# EAGLE board board-auto-wover (EAGLE 9.5.2), part 1 of 2
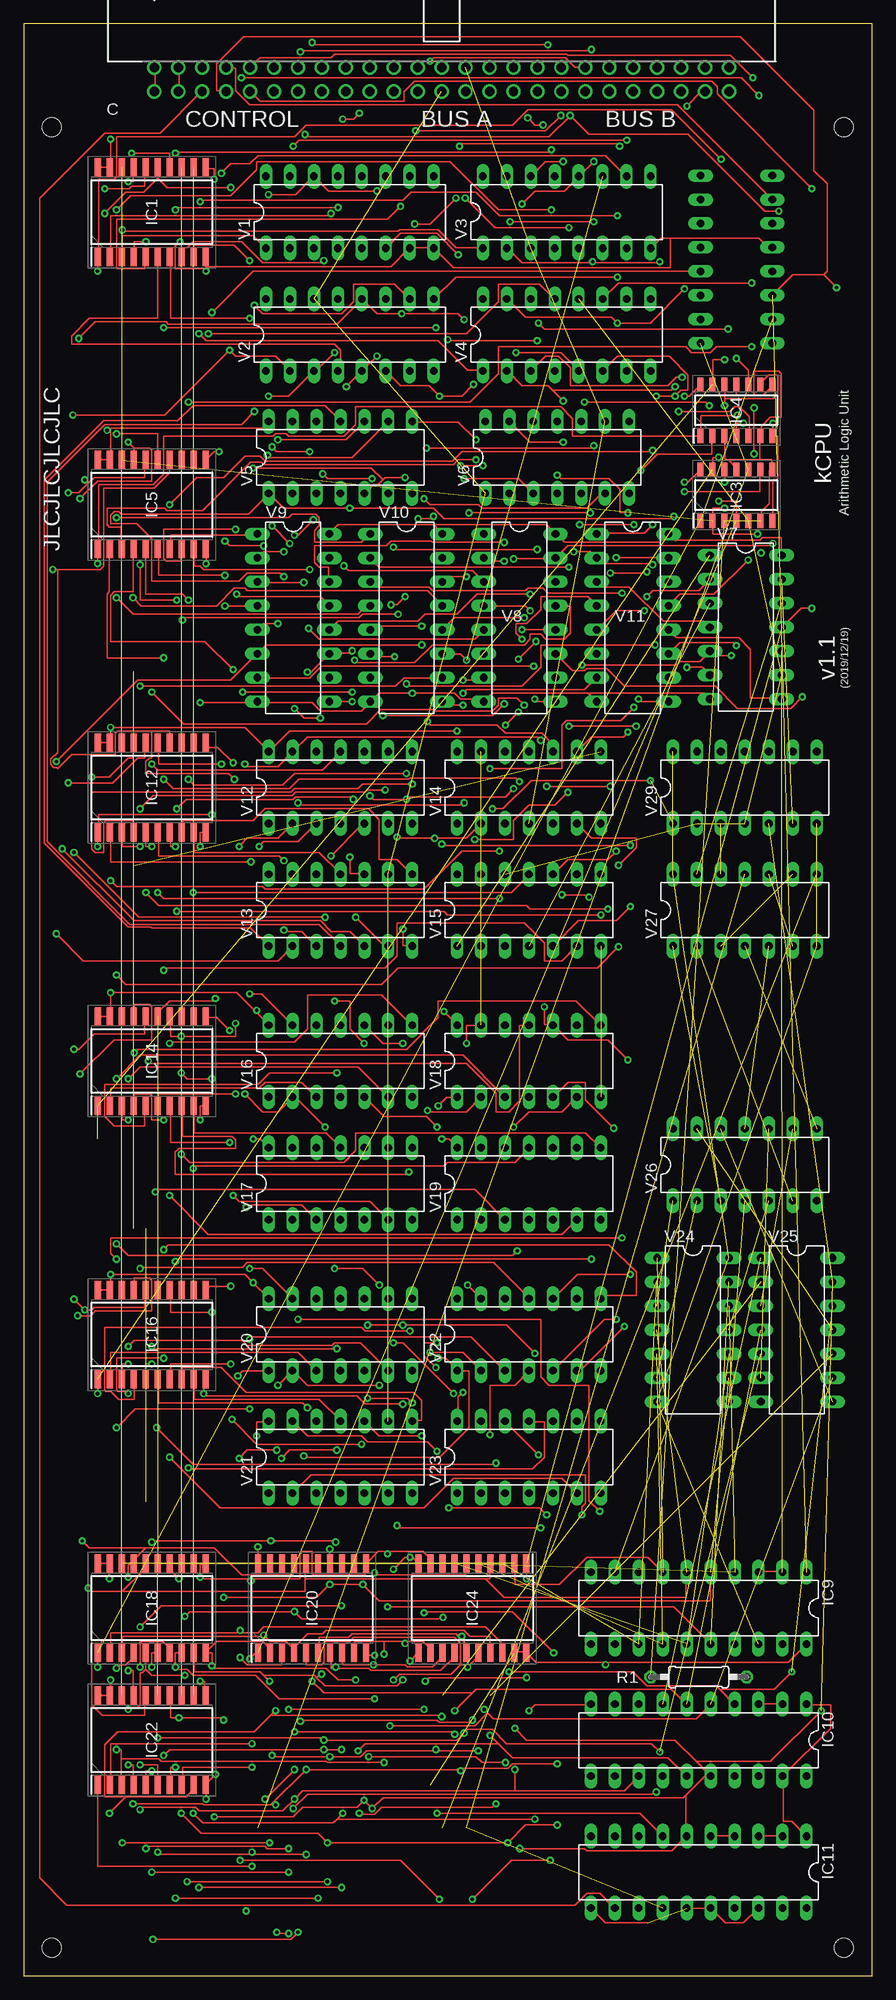
[diagram p7: board, top side]
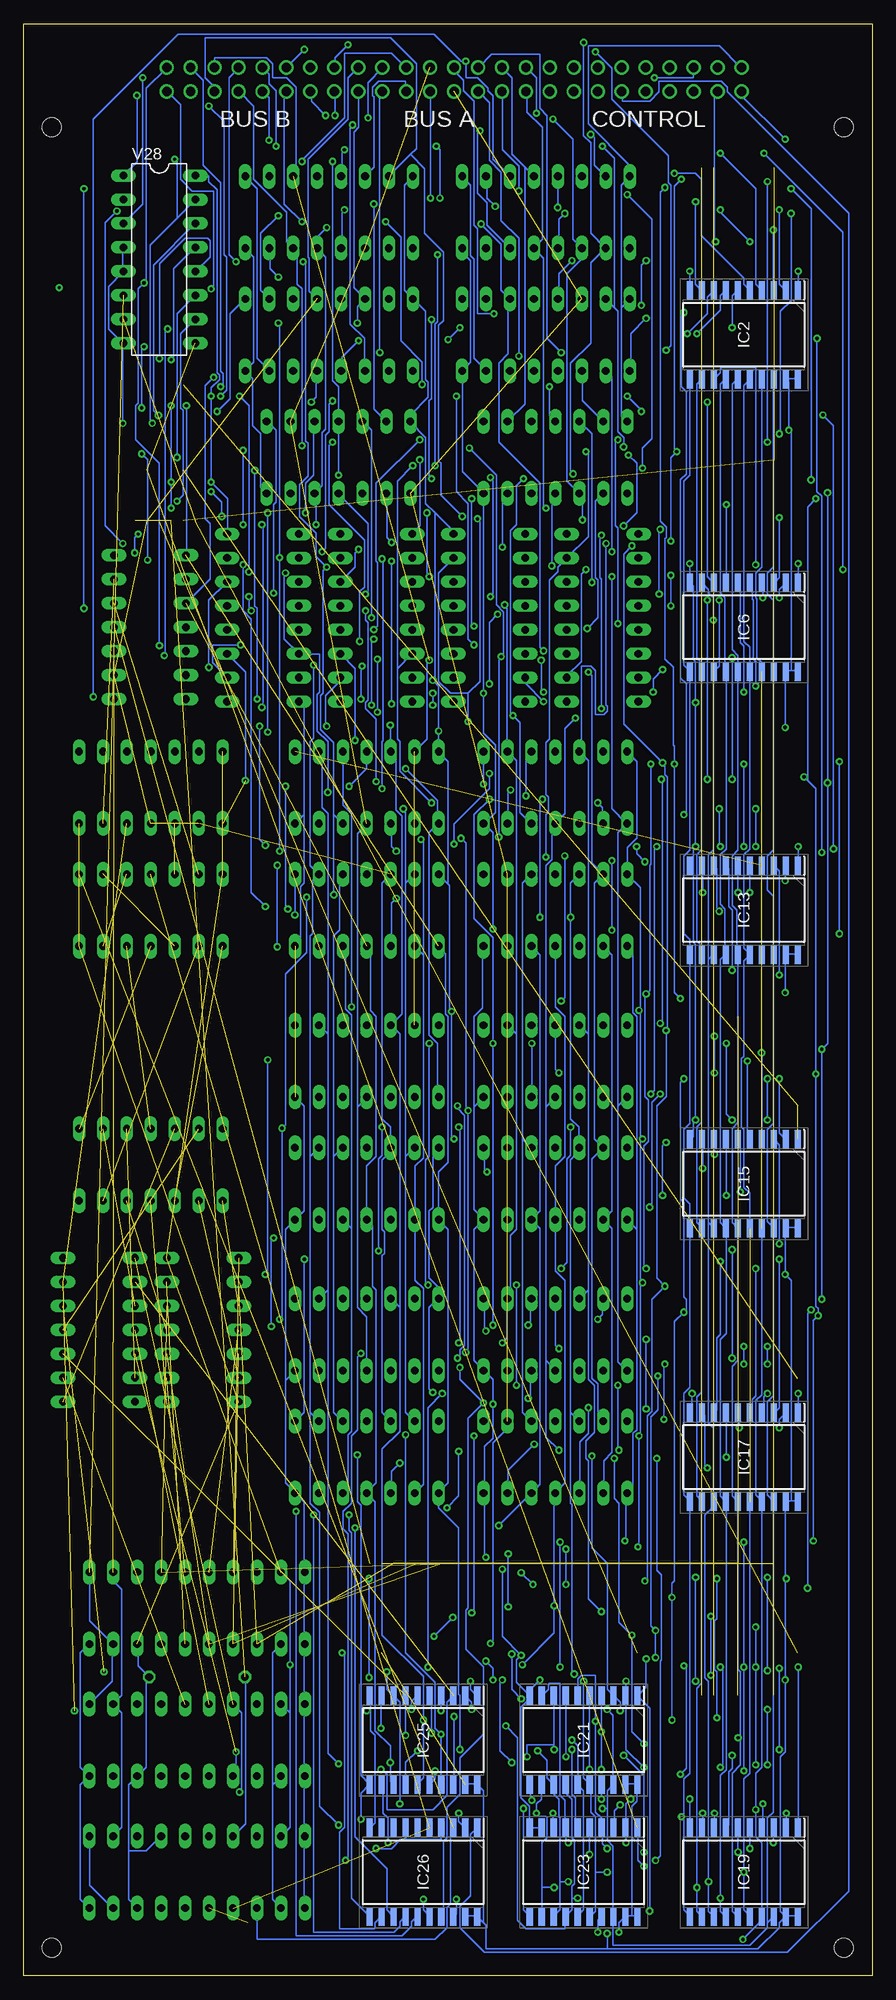
[diagram p8: board, bottom side, seen from below]

Size 90 x 207 mm. Coordinates in mm from the lower left corner, seen from the top.
Outline: 0,0 90,0 90,207 0,207 0,0
Copper layers (1*16): Top 0.035mm / dielectric 1.5mm / Bottom 0.035mm
Design rules "default": minimum track width 6mil, minimum drill 0.35mm, track to track 6mil, track to pad 6mil, pad to pad 6mil, via to via 6mil, smd to smd 6mil, copper to edge 40mil, drill to drill 6mil, minimum pad ring 10mil, minimum via ring 8mil, stop-mask expansion 4mil, vias tented up to drill 0mil, thermal gap 10mil
Holes 2 mm at 3,196 87,196 3,3 87,3

## Footprints (pad centres in the part's own frame; a part is rotated, then mirrored left to right if it is on the bottom)
PAK100/2500-5-50 = drill 1 pad 1.422: 1 -30.48,-1.27; 2 -30.48,1.27; 3 -27.94,-1.27; 4 -27.94,1.27; 5 -25.4,-1.27; 6 -25.4,1.27; 7 -22.86,-1.27; 8 -22.86,1.27; 9 -20.32,-1.27; 10 -20.32,1.27; 11 -17.78,-1.27; 12 -17.78,1.27; 13 -15.24,-1.27; 14 -15.24,1.27; 15 -12.7,-1.27; 16 -12.7,1.27; 17 -10.16,-1.27; 18 -10.16,1.27; 19 -7.62,-1.27; 20 -7.62,1.27; 21 -5.08,-1.27; 22 -5.08,1.27; 23 -2.54,-1.27; 24 -2.54,1.27; 25 0,-1.27; 26 0,1.27; 27 2.54,-1.27; 28 2.54,1.27; 29 5.08,-1.27; 30 5.08,1.27; 31 7.62,-1.27; 32 7.62,1.27; 33 10.16,-1.27; 34 10.16,1.27; 35 12.7,-1.27; 36 12.7,1.27; 37 15.24,-1.27; 38 15.24,1.27; 39 17.78,-1.27; 40 17.78,1.27; 41 20.32,-1.27; 42 20.32,1.27; 43 22.86,-1.27; 44 22.86,1.27; 45 25.4,-1.27; 46 25.4,1.27; 47 27.94,-1.27; 48 27.94,1.27; 49 30.48,-1.27; 50 30.48,1.27
SOIC127P1030X265-20N = smd 1.95 x 0.65: 1 -4.725,5.715; 2 -4.725,4.445; 3 -4.725,3.175; 4 -4.725,1.905; 5 -4.725,0.635; 6 -4.725,-0.635; 7 -4.725,-1.905; 8 -4.725,-3.175; 9 -4.725,-4.445; 10 -4.725,-5.715; 11 4.725,-5.715; 12 4.725,-4.445; 13 4.725,-3.175; 14 4.725,-1.905; 15 4.725,-0.635; 16 4.725,0.635; 17 4.725,1.905; 18 4.725,3.175; 19 4.725,4.445; 20 4.725,5.715
SOIC127P600X175-14N = smd 1.525 x 0.65: 1 -2.712,3.81; 2 -2.712,2.54; 3 -2.712,1.27; 4 -2.712,0; 5 -2.712,-1.27; 6 -2.712,-2.54; 7 -2.712,-3.81; 8 2.712,-3.81; 9 2.712,-2.54; 10 2.712,-1.27; 11 2.712,0; 12 2.712,1.27; 13 2.712,2.54; 14 2.712,3.81
DIL20 = drill 0.813 long: 1 -11.43,-3.81; 2 -8.89,-3.81; 3 -6.35,-3.81; 4 -3.81,-3.81; 5 -1.27,-3.81; 6 1.27,-3.81; 7 3.81,-3.81; 8 6.35,-3.81; 9 8.89,-3.81; 10 11.43,-3.81; 11 11.43,3.81; 12 8.89,3.81; 13 6.35,3.81; 14 3.81,3.81; 15 1.27,3.81; 16 -1.27,3.81; 17 -3.81,3.81; 18 -6.35,3.81; 19 -8.89,3.81; 20 -11.43,3.81
0207/10 = drill 0.813 octagon: 1 -5.08,0; 2 5.08,0
DIL16 = drill 0.813 long: 1 -8.89,-3.81; 2 -6.35,-3.81; 3 -3.81,-3.81; 4 -1.27,-3.81; 5 1.27,-3.81; 6 3.81,-3.81; 7 6.35,-3.81; 8 8.89,-3.81; 9 8.89,3.81; 10 6.35,3.81; 11 3.81,3.81; 12 1.27,3.81; 13 -1.27,3.81; 14 -3.81,3.81; 15 -6.35,3.81; 16 -8.89,3.81
DIL14 = drill 0.813 long: 1 -7.62,-3.81; 2 -5.08,-3.81; 3 -2.54,-3.81; 4 0,-3.81; 5 2.54,-3.81; 6 5.08,-3.81; 7 7.62,-3.81; 8 7.62,3.81; 9 5.08,3.81; 10 2.54,3.81; 11 0,3.81; 12 -2.54,3.81; 13 -5.08,3.81; 14 -7.62,3.81

## Placement (x,y rotation side)
C  2550-5  [PAK100/2500-5-50]  44.34,201.08 0 top
IC1  SN74CBT3345DW  [SOIC127P1030X265-20N]  13.6,187 90 top
IC2  SN74CBT3345DW  [SOIC127P1030X265-20N]  13.6,174 270 bottom
IC3  SN74CBT3126D  [SOIC127P600X175-14N]  75.6,157 90 top
IC4  SN74CBT3126D  [SOIC127P600X175-14N]  75.6,166 90 top
IC5  SN74CBT3345DW  [SOIC127P1030X265-20N]  13.6,156 90 top
IC6  SN74CBT3345DW  [SOIC127P1030X265-20N]  13.6,143 270 bottom
IC9  74S299N  [DIL20]  71.6,39 180 top
IC10  74S299N  [DIL20]  71.6,25 180 top
IC11  74S299N  [DIL20]  71.6,11 180 top
IC12  SN74CBT3345DW  [SOIC127P1030X265-20N]  13.6,126 90 top
IC13  SN74CBT3345DW  [SOIC127P1030X265-20N]  13.6,113 270 bottom
IC14  SN74CBT3345DW  [SOIC127P1030X265-20N]  13.6,97 90 top
IC15  SN74CBT3345DW  [SOIC127P1030X265-20N]  13.6,84 270 bottom
IC16  SN74CBT3345DW  [SOIC127P1030X265-20N]  13.6,68 90 top
IC17  SN74CBT3345DW  [SOIC127P1030X265-20N]  13.6,55 270 bottom
IC18  SN74CBT3345DW  [SOIC127P1030X265-20N]  13.6,39 90 top
IC19  SN74CBT3345DW  [SOIC127P1030X265-20N]  13.6,11 270 bottom
IC20  SN74CBT3345DW  [SOIC127P1030X265-20N]  30.6,39 90 top
IC21  SN74CBT3345DW  [SOIC127P1030X265-20N]  30.6,25 270 bottom
IC22  SN74CBT3345DW  [SOIC127P1030X265-20N]  13.6,25 90 top
IC23  SN74CBT3345DW  [SOIC127P1030X265-20N]  30.6,11 270 bottom
IC24  SN74CBT3345DW  [SOIC127P1030X265-20N]  47.6,39 270 top
IC25  SN74CBT3345DW  [SOIC127P1030X265-20N]  47.6,25 270 bottom
IC26  SN74CBT3345DW  [SOIC127P1030X265-20N]  47.6,11 270 bottom
R1  1k  [0207/10]  71.6,31.7 0 top
V1  74283N  [DIL16]  34.6,187 0 top
V2  74283N  [DIL16]  34.6,174 0 top
V3  74283N  [DIL16]  57.6,187 0 top
V4  74283N  [DIL16]  57.6,174 0 top
V5  7404N  [DIL14]  33.6,161 0 top
V6  7404N  [DIL14]  56.6,161 0 top
V7  7404N  [DIL14]  76.6,143 270 top
V8  74283N  [DIL16]  52.6,144 270 top
V9  74283N  [DIL16]  28.6,144 270 top
V10  74283N  [DIL16]  40.6,144 270 top
V11  74283N  [DIL16]  64.6,144 270 top
V12  7432N  [DIL14]  33.6,126 0 top
V13  7432N  [DIL14]  33.6,113 0 top
V14  7432N  [DIL14]  53.6,126 0 top
V15  7432N  [DIL14]  53.6,113 0 top
V16  7408N  [DIL14]  33.6,97 0 top
V17  7408N  [DIL14]  33.6,84 0 top
V18  7408N  [DIL14]  53.6,97 0 top
V19  7408N  [DIL14]  53.6,84 0 top
V20  7486N  [DIL14]  33.6,68 0 top
V21  7486N  [DIL14]  33.6,55 0 top
V22  7486N  [DIL14]  53.6,68 0 top
V23  7486N  [DIL14]  53.6,55 0 top
V24  7432N  [DIL14]  71,68.5 270 top
V25  7432N  [DIL14]  82,68.5 270 top
V26  7432N  [DIL14]  76.5,86 0 top
V27  7432N  [DIL14]  76.5,113 0 top
V28  74238N  [DIL16]  75.6,182 270 bottom
V29  7486N  [DIL14]  76.5,126 0 top

## Tracks (layer width: path | path; a pad name or v marks a point on that pad's centre or on a via)
BUSA_BIT0  (via drill 0.35)
  Top 0.152: v70.1,157.38 78.1,157.38 78.1,159.62 IC3.9 | v68.97,154.75 68.72,154.5 44.6,154.5 43.48,155.62 v34.6,155.62 27.6,155.62 26.1,157.12 V5.1 25.98,157.12 23.85,155 10.35,155 10.1,155.25 9.6,155.25 9.22,154.88 9.22,154 11.97,154 13.6,152.38 13.6,147.88 22.85,147.88 23.73,148.75 27.23,148.75 v27.6,148.38 | 22.98,36.38 24.85,36.38 25.48,37 48.98,37 50.73,35.25 50.73,34.38 IC24.18 | 22.98,36.38 9.22,36.38 9.22,34.38 IC18.2 | v22.98,33.75 23.73,33 27.35,33 27.35,34.25 IC20.3 | 22.98,36.38 v22.98,36.62 | v22.73,63.62 23.23,64.12 25.98,64.12 V20.1
  Bottom 0.152: C.19 36.6,199.75 36.6,197.62 34.98,196 34.98,184.12 35.85,183.25 V1.5 35.85,183.12 34.85,182.12 34.85,155.88 v34.6,155.62 | v70.1,157.38 68.97,156.25 v68.97,154.75 | v22.98,33.75 v22.98,36.62 23.48,37.12 23.48,59.25 22.73,60 v22.73,63.62 | 26.98,92.25 26.98,65.12 26.1,64.25 V20.1 | 26.98,92.25 26.1,93.12 V16.1 | 26.98,92.25 26.98,121.25 26.1,122.12 V12.1 26.1,122.25 27.6,123.75 v27.6,148.38
BUSA_BIT1  (via drill 0.35)
  Top 0.152: v24.23,24.62 9.22,24.62 9.22,20.38 IC22.2 | 25.6,36 26.1,35.5 27.85,35.5 28.6,34.75 | 28.6,34.75 28.6,34.38 IC20.4 28.6,34.75 | 25.6,36 10.47,36 10.47,34.38 IC18.3 | 25.6,36 v25.48,36.12 | 28.6,34.75 30.1,36.25 31.73,36.25 32.1,36.62 46.73,36.62 47.35,36 49.48,36 49.48,34.38 IC24.17 | v35.6,197.5 34.98,196.88 v33.85,196.88 | v30.73,154.38 29.1,152.75 v28.73,152.75 | v28.73,134.38 29.73,133.38 v31.48,133.38 | v27.35,54.88 28.23,55.75 v33.23,55.75
  Bottom 0.152: v24.23,24.62 25.48,25.88 v25.48,36.12 26.85,37.5 26.85,50.12 27.35,50.62 v27.35,54.88 | v35.6,197.5 35.6,201.25 36.6,202.25 C.20 | v33.85,196.88 31.73,194.75 31.73,184.12 V1.3 30.85,183.12 30.85,182 32.35,180.5 32.35,158.5 31.1,157.25 V5.3 30.98,157.12 30.73,156.88 v30.73,154.38 | 34.6,65.25 33.6,64.25 V20.4 | 34.6,92.12 34.6,65.25 | 34.6,92.12 33.6,93.12 V16.4 | 34.6,92.12 34.6,117.75 33.98,118.38 33.98,121.75 33.6,122.12 V12.4 33.6,122.25 32.6,123.25 32.6,132.25 v31.48,133.38 | v28.73,152.75 28.85,152.62 28.85,148.25 28.73,148.12 v28.73,134.38 | v33.23,55.75 34.6,57.12 34.6,65.25
BUSA_BIT2  (via drill 0.35)
  Top 0.152: 10.35,23 10.35,24 v9.85,24 | 10.35,23 10.35,20.38 IC22.3 | v9.85,32.62 10.22,33 10.85,33 11.6,33.75 11.6,34.25 IC18.4 | 46.35,33 46.35,35.25 45.73,35.88 34.98,35.88 34.6,35.5 31.85,35.5 31.85,33.25 31.6,33 29.98,33 29.98,34.25 IC20.5 | 47.1,33 47.35,33 48.23,33.88 48.23,34.25 IC24.16 | 47.1,33 46.35,33 | 10.35,23 14.35,23 14.6,22.75 32.1,22.75 32.23,22.62 v38.23,22.62 | v39.23,31.38 39.85,32 45.35,32 46.35,33 | v37.48,189.25 32.35,189.25 V1.14 30.73,190.75 28.85,188.88 v25.98,188.88 | 38.1,158.62 38.35,158.88 v40.48,158.88 | 38.1,158.62 37.6,158.12 37.1,158.12 36.23,157.25 V5.5 | v40.48,146.25 39.6,145.38 v38.98,145.38 | v24.35,159.88 36.85,159.88 38.1,158.62 | v47.1,32.75 47.1,33 | v45.6,61.75 40.23,67.12 v39.23,67.12
  Bottom 0.152: v9.85,32.62 v9.85,24 | v38.23,22.62 39.48,23.88 39.48,31.12 v39.23,31.38 | v37.48,189.25 37.48,191.88 39.23,193.62 39.23,199.75 C.21 | 37.73,99.88 37.73,79.12 38.35,78.5 38.35,72.12 38.6,71.88 V20.9 38.73,71.75 38.73,67.62 v39.23,67.12 | 37.73,99.88 38.6,100.75 V16.9 | 37.73,99.88 37.73,128.88 38.6,129.75 V12.9 38.73,129.88 38.73,145.12 v38.98,145.38 | v40.48,158.88 40.23,158.62 40.23,146.5 v40.48,146.25 | v25.98,188.88 23.35,186.25 23.35,163 24.35,162 v24.35,159.88 | v47.1,32.75 47.1,60.25 v45.6,61.75
BUSA_BIT3  (via drill 0.35)
  Top 0.152: 46.23,35.88 46.85,35.25 46.85,34.38 IC24.15 | 46.23,35.88 45.85,36.25 34.85,36.25 34.48,35.88 31.35,35.88 31.35,34.38 IC20.6 | v11.1,22.38 11.6,22.38 11.6,20.38 IC22.4 | v11.1,28.25 11.35,28.5 12.1,28.5 12.35,28.75 12.35,32.12 12.6,32.12 12.97,32.5 | 12.97,32.5 12.97,34.25 IC18.5 | 12.97,32.5 13.6,31.88 v17.1,31.88 | v17.1,38.12 17.6,38.62 v28.73,38.62 29.48,37.88 44.35,37.88 v44.48,38 | 46.23,35.88 46.35,36 v46.48,36 | v25.85,161.25 26.1,161 34.85,161 38.6,164.75 V5.9 | v28.23,151.88 v26.35,153.75
  Bottom 0.152: 36.85,191.75 38.23,193.12 38.23,201.25 39.23,202.25 C.22 | 36.85,191.75 35.98,190.88 V1.12 | 36.85,191.75 36.85,166.62 38.6,164.88 V5.9 | v11.1,28.25 v11.1,22.38 | 30.1,72.75 30.98,71.88 V20.12 | 30.1,99.88 30.1,72.75 | 30.1,99.88 30.98,100.75 V16.12 | 30.85,129.62 30.1,128.88 30.1,99.88 | 30.85,129.62 30.98,129.75 V12.12 30.85,129.62 | v17.1,38.12 v17.1,31.88 | v28.73,38.62 30.1,40 30.1,54.62 30.35,54.88 30.35,56.75 29.48,57.62 29.48,62.62 30.1,63.25 30.1,72.75 | v44.48,38 v46.48,36 | v25.85,161.25 24.98,160.38 24.98,155.12 v26.35,153.75 | v28.23,151.88 28.23,134.75 28.1,134.62 28.1,134.12 28.48,133.75 29.35,133.75 29.35,138.38 29.85,138.88 30.85,138.88 30.85,129.62
BUSA_BIT4  (via drill 0.35)
  Top 0.152: v34.23,168.5 35.85,170.12 V2.5 35.98,170.25 v37.48,171.75 | v13.6,21.75 12.97,21.75 12.97,20.38 IC22.5 | v13.6,32.75 13.6,34.25 14.22,34.25 IC18.6 | 33.1,32.62 36.6,32.62 36.85,32.38 44.23,32.38 45.6,33.75 45.6,34.25 IC24.14 | 33.1,32.62 32.6,32.62 32.6,34.25 IC20.7 | v33.1,32.75 33.1,32.62 | v33.1,46 32.98,46.12 v26.23,46.12 13.72,46.12 v13.6,46 | V5.11 33.6,164.88 31.98,166.5 17.98,166.5 16.35,164.88 8.47,164.88 2.19,158.59 2.19,120.12 11.12,111.19 13.53,111.19 13.6,111.12 24.1,111.12 25.98,109.25 V13.1
  Bottom 0.152: v34.23,168.5 34.23,165.5 33.6,164.88 V5.11 | v37.48,171.75 37.48,184.25 39.35,186.12 39.35,191.25 40.6,192.5 40.6,198.62 41.73,199.75 C.23 | v13.6,21.75 v13.6,32.75 v13.6,46 | 24.98,79.12 24.98,57.88 25.35,57.5 25.35,51.88 25.98,51.25 V21.1 26.1,51.12 26.1,46.25 v26.23,46.12 | 24.98,79.12 25.98,80.12 V17.1 | 24.98,79.12 24.98,101.75 25.35,102.12 25.35,108.5 25.98,109.12 V13.1 | v33.1,46 v33.1,32.75
BUSA_BIT5  (via drill 0.35)
  Top 0.152: v32.98,172.12 31.1,170.25 30.85,170.25 V2.3 28.1,167.5 v25.98,167.5 | v12.35,22.38 14.22,22.38 14.22,20.38 IC22.6 | v12.35,32.75 12.35,35.5 14.72,35.5 15.47,34.75 15.47,34.38 IC18.7 | IC20.8 33.85,34.25 33.85,33 v37.1,33 40.48,33 40.73,32.75 43.35,32.75 44.35,33.75 44.35,34.25 IC24.13 | v12.35,37 14.6,39.25 v33.73,39.25 | v24.48,165.88 23.1,164.5 8.6,164.5 2.49,158.39 2.49,120.25 11.24,111.5 31.35,111.5 33.6,109.25 V13.4
  Bottom 0.152: V5.13 28.6,164.88 30.73,167 30.73,170.12 V2.3 | v32.98,172.12 34.48,173.62 34.48,197.25 35.23,198 35.23,203.75 40.35,203.75 41.73,202.38 C.24 | v12.35,22.38 v12.35,32.75 v12.35,37 | V13.4 33.6,102.75 32.6,101.75 32.6,86.88 33.6,85.88 V17.4 33.6,74.75 32.6,73.75 32.6,52.25 33.6,51.25 V21.4 33.6,51.12 33.73,51 v33.73,39.25 33.73,36.38 v37.1,33 | v25.98,167.5 24.48,166 v24.48,165.88
BUSA_BIT6  (via drill 0.35)  (5 unrouted)
  Top 0.152: v16.1,22.12 15.6,22.12 15.6,20.38 IC22.7 | IC18.8 16.73,34.25 16.1,34.25 v16.1,32.75 16.35,32.5 17.35,32.5 17.98,31.88 24.6,31.88 27.1,29.38 v37.23,29.38 | 40.48,35.5 42.35,35.5 43.1,34.75 43.1,34.38 IC24.12 | 40.48,35.5 38.23,35.5 | 38.23,35.5 35.1,35.5 35.1,34.38 IC20.9 | v40.48,35.25 40.48,35.5 | 38.23,35.5 v38.23,34.12
  Bottom 0.152: v16.1,22.12 15.85,22.38 15.85,32.5 v16.1,32.75 | v40.48,35.25 40.23,35.5 40.23,56.5 38.73,58 38.73,58.75 V21.9 | v37.23,29.38 38.23,30.38 v38.23,34.12
BUSA_BIT7  (via drill 0.35)
  Top 0.152: v46.73,158.75 52.48,158.75 53.98,157.25 V6.3 | v46.73,175.62 46.1,176.25 v40.1,176.25 37.48,176.25 35.98,177.75 V2.12 35.85,177.75 33.23,175.12 15.35,175.12 15.1,175.38 7.6,175.38 v5.85,173.62 | v24.23,22.12 16.85,22.12 16.85,20.38 IC22.8 | v26.1,31.25 25.48,31.88 | 25.48,31.88 25.1,32.25 18.1,32.25 18.1,34.25 IC18.9 | v40.98,33.38 41.85,34.25 IC24.11 | v40.23,31.38 39.6,30.75 31.98,30.75 31.1,31.62 | 31.1,31.62 30.85,31.88 25.48,31.88 | 31.1,31.62 31.48,32 v31.6,32 | v5.35,119.12 12.22,112.25 v31.98,112.25
  Bottom 0.152: v40.1,176.25 41.85,176.25 41.85,185.25 42.23,185.62 42.23,198.75 43.35,199.88 43.35,201 44.23,201.88 44.23,202.25 C.26 | v46.73,158.75 46.98,159 46.98,167 46.73,167.25 v46.73,175.62 | v24.23,22.12 26.1,24 26.1,29.62 IC21.2 26.1,29.75 v26.1,31.25 | v40.98,33.38 40.23,32.62 v40.23,31.38 | 31.98,59.75 31.1,58.88 V21.12 | 31.98,59.75 31.98,86.5 31.1,87.38 31.1,87.75 V17.12 31.1,87.88 31.1,90 31.98,90.88 v31.98,112.25 31.98,115.88 31.1,116.75 V13.12 | v31.6,32 31.85,32.25 31.85,50 31.98,50.12 31.98,59.75 | v5.85,173.62 5.85,157.38 5.35,156.88 v5.35,119.12
BUSA_BIT8  (via drill 0.35)
  Top 0.152: v46.85,188.5 49.98,185.38 v57.85,185.38 | 10.85,19 v9.1,17.25 | 10.85,19 17.23,19 17.98,19.75 17.98,20.25 IC22.9 | 26.23,27.62 24.48,25.88 9.97,25.88 8.6,24.5 8.6,19 10.85,19 | 26.23,27.62 v26.73,28.12 | v44.35,27.5 44.23,27.62 26.23,27.62 | v43.98,65.5 44.73,65.5 45.98,64.25 V22.1 46.1,64.12 47.23,64.12 47.23,58.12 44.1,55 29.85,55 v29.73,55.12 | v43.98,92.25 44.85,93.12 45.98,93.12 V18.1 | v64.72,153.88 v58.98,153.88 | v64.72,134.5 63.35,133.12 57.6,133.12 57.1,132.62 57.1,128 v49.48,128
  Bottom 0.152: v46.85,188.5 46.85,199.75 C.27 | v57.85,185.38 58.85,184.38 58.85,183.25 V3.5 58.85,183.12 57.98,182.25 57.98,164 58.35,163.62 58.35,158 59.1,157.25 V6.5 59.1,157.12 58.98,157 v58.98,153.88 | v9.1,17.25 9.1,15.75 IC19.2 | v26.73,28.12 26.73,29 27.35,29.62 IC21.3 27.48,29.75 28.1,30.38 28.1,43.75 29.73,45.38 v29.73,55.12 | v44.35,27.5 44.35,20.38 IC25.18 | v43.98,65.5 43.73,65.75 43.73,66.38 43.23,66.88 43.23,91.25 43.98,92 v43.98,92.25 | V18.1 46.1,93.25 46.1,98.88 46.98,99.75 46.98,121.25 46.1,122.12 V14.1 46.1,122.25 46.1,124.62 v49.48,128 | v64.72,153.88 64.6,153.75 64.6,134.62 v64.72,134.5
BUSA_BIT9  (via drill 0.35)  (3 unrouted)
  Top 0.152: v26.1,14.12 v10.47,14.12 | v25.6,18.75 v28.73,21.88 | v45.73,25.62 45.48,25.88 v28.73,25.88 | v49.48,57.38 49.48,62.62 52.1,62.62 53.6,64.12 V22.4
  Bottom 0.152: v10.47,14.12 10.47,15.62 IC19.3 | v26.1,14.12 26.1,15.62 IC23.2 26.1,15.75 26.1,18.25 v25.6,18.75 | v28.73,21.88 v28.73,25.88 28.73,29.62 IC21.4 | IC25.17 45.73,20.38 v45.73,25.62 46.35,26.25 46.35,31.12 49.48,34.25 v49.48,57.38 | V22.4 53.6,69.88 54.6,70.88 54.6,92.12 | 54.6,92.12 53.6,93.12 V18.4 | 54.6,92.12 54.6,121.12 53.6,122.12 V14.4
BUSA_BIT10  (via drill 0.35)
  Top 0.152: v11.6,18.25 18.98,18.25 19.1,18.12 26.23,18.12 | v26.73,18.12 26.23,18.12 | 26.23,18.12 v29.98,21.88 46.23,21.88 v46.35,21.75 46.6,22 51.35,22 51.85,22.5 v56.6,22.5 | v57.23,192.38 55.35,192.38 53.85,190.88 V3.14 | v56.6,159.12 56.98,158.75 62.1,158.75 63.23,157.62 63.23,155.12 v64.1,155.12 | v64.1,131.88 63.6,131.38 60.23,131.38 58.73,129.88 V14.9
  Bottom 0.152: v11.6,18.25 11.6,15.75 IC19.4 | v26.73,18.12 27.35,17.5 27.35,15.75 IC23.3 | v29.98,21.88 29.98,29.62 IC21.5 | v46.35,21.75 46.35,20.88 46.85,20.38 IC25.16 | V3.14 52.85,191.75 52.85,199.25 52.98,199.38 52.98,200.25 52.35,200.88 49.48,200.88 49.48,199.88 C.29 | v57.23,192.38 57.23,169.12 56.6,168.5 V6.11 v56.6,159.12 | 57.73,72.75 58.6,71.88 V22.9 | 57.73,99.88 57.73,72.75 | 57.73,99.88 58.6,100.75 V18.9 | 57.73,99.88 57.73,123.25 58.35,123.88 58.35,129.5 58.6,129.75 V14.9 | v64.1,131.88 v64.1,155.12 | v56.6,22.5 57.73,23.62 57.73,72.75
BUSA_BIT11  (via drill 0.35)
  Top 0.152: v52.85,187.88 54.23,189.25 57.35,189.25 58.85,190.75 V3.12 58.98,190.88 v60.48,192.38 | v12.97,13.5 13.22,13.75 25.6,13.75 25.85,13.5 v28.1,13.5 | v29.35,27 29.48,27.12 43.85,27.12 44.1,26.88 47.35,26.88 v47.6,27.12 | v57.23,162.62 53.73,162.62 51.6,164.75 V6.13 | v52.48,139.62 v54.35,141.5 | v51.1,132.62 v52.48,134
  Bottom 0.152: v52.85,187.88 52.85,166.12 51.6,164.88 V6.13 | v60.48,192.38 60.48,192.5 55.98,197 55.98,203.88 50.98,203.88 49.48,202.38 C.30 | v12.97,13.5 12.97,15.62 IC19.5 | v28.1,13.5 28.6,14 28.6,15.62 IC23.4 28.73,15.75 28.73,16.75 29.35,17.38 v29.35,27 29.35,31.88 30.85,31.88 31.23,31.5 31.23,29.75 IC21.6 | 50.1,70.88 50.1,57.75 51.98,55.88 51.98,36.12 47.6,31.75 v47.6,27.12 47.6,21 48.23,20.38 IC25.15 | 50.1,70.88 50.98,71.75 V22.12 | 50.1,70.88 50.1,99.88 50.98,100.75 V18.12 50.98,100.88 49.85,102 49.85,123 50.48,123.62 50.48,129.25 50.98,129.75 V14.12 51.1,129.88 v51.1,132.62 | v57.23,162.62 57.6,162.25 57.6,156 53.85,152.25 53.85,147.25 54.35,146.75 v54.35,141.5 | v52.48,134 v52.48,139.62
BUSA_BIT12  (via drill 0.35)  (1 unrouted)
  Top 0.152: v52.23,172.12 56.98,172.12 58.85,170.25 V4.5 | v72.72,166.5 72.35,166.88 v59.48,166.88 | v14.22,13.12 14.47,12.88 24.23,12.88 | v29.98,12.88 24.23,12.88 | v48.23,23.88 43.73,23.88 | 43.73,23.88 36.35,23.88 35.73,23.25 v32.48,23.25 26.48,23.25 v26.35,23.38 | v24.23,13.12 24.23,12.88 | v43.73,24 43.73,23.88
  Bottom 0.152: v52.23,172.12 52.23,199.5 51.98,199.75 C.31 | v72.72,166.5 72.72,150.62 V7.1 | v59.48,166.88 58.98,167.38 58.98,170.12 V4.5 | v14.22,13.12 14.22,15.62 IC19.6 | v29.98,12.88 29.98,15.62 IC23.5 | v32.48,23.25 32.48,29.62 IC21.7 | v48.23,23.88 49.48,22.62 49.48,20.38 IC25.14 | v24.23,13.12 24.23,21.25 v26.35,23.38 | V15.1 45.98,109.12 45.23,108.38 45.23,102 44.98,101.75 44.98,86.25 45.98,85.25 45.98,80.25 V19.1 45.98,80.12 44.98,79.12 44.98,52.25 45.98,51.25 V23.1 45.98,51.12 45.98,49.62 43.85,47.5 43.85,29.88 43.73,29.75 v43.73,24
BUSA_BIT13  (via drill 0.35)  (1 unrouted)
  Top 0.152: V4.3 55.35,171.75 56.73,171.75 57.98,170.5 57.98,168.62 68.35,168.62 69.22,169.5 v69.85,169.5 | v53.48,197 54.23,196.25 v55.1,196.25 | v14.85,23.38 15.47,24 v31.85,24 v33.73,24 | v36.6,23.25 47.98,23.25 48.6,22.62 v51.1,22.62
  Bottom 0.152: v69.85,169.5 70.72,168.62 70.72,154.5 70.22,154 70.22,148.12 72.72,145.62 V7.3 | v53.48,197 53.48,200.75 51.98,202.25 C.32 | v55.1,196.25 55.35,196 55.35,175.12 53.85,173.62 53.85,170.25 V4.3 | v14.85,23.38 14.85,22 15.22,21.62 15.22,16 15.47,15.75 IC19.7 | 33.73,24.5 33.73,29.62 IC21.8 | 33.73,24.5 v33.73,24 | v31.85,24 31.85,19.25 31.48,18.88 31.48,15.88 31.35,15.75 IC23.6 | IC25.13 50.85,20.38 51.1,20.62 v51.1,22.62 51.1,24.38 52.73,26 52.73,50.25 53.6,51.12 V23.4 53.6,51.25 52.6,52.25 52.6,72.75 52.98,73.12 52.98,79.5 53.6,80.12 V19.4 53.6,85.88 52.6,86.88 52.6,101.75 53.23,102.38 53.23,108.75 53.6,109.12 V15.4 | 33.73,24.5 36.6,24.5 v36.6,23.25
BUSA_BIT14  (via drill 0.35)
  Top 0.152: v16.73,17.25 18.85,15.12 31.23,15.12 v32.23,14.12 v51.35,14.12 53.23,16 v56.6,16 | v59.23,139 69.22,139 69.6,139.38 71.72,139.38 72.72,140.38 V7.5 73.25,140 v75.08,140 | v54.6,175.25 55.23,174.62 v74.72,174.62
  Bottom 0.152: v16.73,17.25 16.73,15.75 IC19.8 | v32.23,14.12 32.48,14.38 32.48,15.62 IC23.7 32.6,15.75 32.6,18.62 33.1,19.12 33.1,31 34.23,31 34.35,30.88 34.35,30.38 34.98,29.75 IC21.9 | v51.35,14.12 51.35,16.75 51.85,17.25 51.85,20.12 51.98,20.25 IC25.12 | C.33 54.48,199.75 54.48,196 54.98,195.5 54.98,179 53.85,177.88 V4.14 54.6,177 v54.6,175.25 | 59.6,59.75 58.73,58.88 V23.9 | 59.6,86.88 59.6,59.75 | 59.6,86.88 58.73,87.75 V19.9 | 59.6,86.88 59.6,110.25 59.35,110.5 59.35,116.12 58.73,116.75 V15.9 58.73,116.88 59.6,117.75 59.6,130.88 59.23,131.25 v59.23,139 | v74.72,174.62 74.99,174.36 74.99,140.08 v75.08,140 | v56.6,16 58.6,18 58.6,49.12 59.6,50.12 59.6,59.75
BUSA_BIT15  (via drill 0.35)  (5 unrouted)
  Top 0.152: v17.98,17.25 18.98,16.25 32.85,16.25 33.23,16.62 | v33.85,17.25 33.23,16.62 | 33.23,16.62 v54.23,16.62 | v54.6,55.25 51.1,58.75 V23.12
  Bottom 0.152: v17.98,17.25 17.98,15.75 IC19.9 | v33.85,17.25 33.85,15.75 IC23.8 | v54.23,16.62 54.23,19.38 53.35,20.25 IC25.11 53.35,20.38 54.23,21.25 54.23,49.88 54.6,50.25 v54.6,55.25 | C.34 55.6,201.25 55.6,196.88 59.85,192.62 59.85,182.25 59.73,182.12 59.73,178.62 58.98,177.88 V4.12 | V23.12 51.1,58.88 51.98,59.75 51.98,76.38 51.73,76.62 51.73,78.88 51.98,79.12 51.98,86.5 51.1,87.38 51.1,87.75 V19.12 51.1,87.88 51.1,90 51.98,90.88 51.98,115.88 51.1,116.75 V15.12
BUSB_BIT0  (via drill 0.35)
  Top 0.152: v44.1,8.12 39.98,12.25 v22.98,12.25 | v22.85,54.88 23.73,55.75 v26.85,55.75 | v26.98,62.62 28.48,64.12 V20.2 28.6,64.12 30.1,62.62 v37.73,62.62 | v41.6,195.62 55.35,195.62 v56.98,197.25 | v23.48,93.5 25.35,91.62 26.98,91.62 28.48,93.12 V16.2 28.6,93.12 28.85,93.12 v31.98,90 | v22.85,119.75 23.73,120.62 26.98,120.62 28.48,122.12 V12.2 | v46.73,124.38 46.48,124.12 29.35,124.12 v29.1,124.38 | v46.1,182.5 43.85,184.75 39.98,184.75 38.48,183.25 V1.6 | v48.73,160.12 v46.35,160.12 | v37.73,73.25 35.98,75 v32.98,75
  Bottom 0.152: v44.1,8.12 44.1,6.62 44.35,6.38 IC26.18 | v22.98,12.25 22.48,12.75 22.48,33.38 22.35,33.5 22.35,42.5 22.85,43 v22.85,54.88 | v26.85,55.75 26.98,55.88 v26.98,62.62 | v41.6,195.62 41.85,195.38 41.85,189 40.85,188 40.85,185.62 38.48,183.25 V1.6 | v56.98,197.25 56.98,199.75 C.35 | v23.48,93.5 23.1,93.88 23.1,119.5 v22.85,119.75 | 50.35,138.62 48.85,140.12 V8.6 | 50.35,138.62 50.35,131.12 50.1,130.88 50.1,127.75 v46.73,124.38 | v29.1,124.38 28.6,123.88 28.6,122.25 V12.2 | v46.1,182.5 46.1,175.38 46.35,175.12 v46.35,160.12 | v48.73,160.12 50.35,158.5 50.35,138.62 | v37.73,73.25 v37.73,62.62 | v32.98,75 32.35,75.62 32.35,86.62 31.98,87 v31.98,90
BUSB_BIT1  (via drill 0.35)
  Top 0.152: v41.23,60.75 40.73,61.25 v36.48,61.25 | v30.6,205 30.85,204.75 v55.6,204.75 | v36.1,98.88 34.6,100.38 34.6,103.38 v32.98,103.38 | v32.6,118.75 35.98,122.12 36.1,122.12 V12.5 | v50.98,150 49.1,150 48.85,150.25 V8.2 | v50.98,134.88 49.73,133.62 v38.1,133.62 | v31.73,159.25 32.23,158.75 v36.98,158.75 | v43.73,64.5 42.48,65.75 42.48,67.12 v43.85,67.12 | v43.85,90 42.73,91.12 38.23,91.12 36.23,93.12 V16.5
  Bottom 0.152: v36.48,61.25 36.23,61.5 36.23,64.12 V20.5 | IC26.17 45.6,6.38 45.48,6.5 45.48,14.25 45.1,14.62 45.1,17.88 43.73,19.25 43.73,23.12 41.23,25.62 41.23,32.75 43.1,34.62 43.1,38.75 42.85,39 42.85,59.12 v41.23,60.75 43.73,63.25 v43.73,64.5 | v30.6,205 30.6,195.12 29.85,194.38 29.85,184.75 28.35,183.25 V1.2 28.35,183.12 29.85,181.62 29.85,173.12 31.98,171 31.98,159.5 v31.73,159.25 | v55.6,204.75 56.98,203.38 56.98,202.38 C.36 | v36.1,98.88 36.1,93.25 V16.5 | v32.98,103.38 32.6,103.75 v32.6,118.75 | v50.98,134.88 v50.98,150 | V12.5 36.23,122.25 37.35,123.38 37.35,132.88 v38.1,133.62 38.35,133.88 38.35,153.25 37.73,153.88 37.73,158 v36.98,158.75 | v43.85,67.12 43.73,67.25 43.73,89.88 v43.85,90
BUSB_BIT2  (via drill 0.35)
  Top 0.152: v29.85,195.25 30.1,195 55.73,195 v57.98,197.25 59.98,195.25 70.47,195.25 78.6,187.12 v80.1,187.12 | v47.6,8.12 51.73,12.25 v55.85,12.25 | v54.23,66 51.23,69 v40.23,69 v36.48,69 | v40.23,98.88 38.1,98.88 36.23,100.75 V16.10 | v36.73,125.12 37.1,124.75 v40.6,124.75 40.85,125 51.1,125 v51.98,125.88 | v51.98,150.25 56.35,150.25 V8.15 56.48,150.38 57.73,151.62 79.22,151.62 v79.47,151.88
  Bottom 0.152: v29.85,195.25 29.48,194.88 29.48,192 28.35,190.88 V1.15 | v57.98,197.25 59.48,198.75 59.48,199.75 C.37 | v47.6,8.12 47.6,7 46.98,6.38 IC26.16 | v55.85,12.25 55.6,12.5 55.6,46.88 56.1,47.38 56.1,49.25 55.23,50.12 55.23,57.25 54.6,57.88 54.6,65.62 v54.23,66 | v36.48,69 36.23,69.25 36.23,71.75 V20.10 | v40.23,69 v40.23,98.88 40.23,110.12 42.23,112.12 42.23,123.12 v40.6,124.75 | v36.73,125.12 36.73,129.25 36.23,129.75 V12.10 | v51.98,150.25 51.85,150.12 51.85,131 51.98,130.88 v51.98,125.88 | v80.1,187.12 81.35,185.88 81.35,153.75 v79.47,151.88
BUSB_BIT3  (via drill 0.35)
  Top 0.152: v61.1,49.25 59.98,50.38 59.98,62.62 55.73,62.62 54.85,63.5 54.85,69.62 v29.1,69.62 | v43.1,203 43.48,203.38 57.48,203.38 58.48,202.38 59.48,202.38 C.38 | v23.98,104.12 25.23,104.12 28.48,100.88 V16.13 | v23.48,128.5 23.73,128.25 26.98,128.25 28.48,129.75 V12.13 28.6,129.88 30.1,131.38 54.48,131.38 v54.85,131 | v82.6,135.62 81.35,134.38 75.72,134.38 73.35,136.75 63.73,136.75 61.85,138.62 59.73,138.62 59.48,138.38 58.23,138.38 V8.11 | v23.98,75 25.35,75 28.48,71.88 V20.13
  Bottom 0.152: v61.1,49.25 61.1,4.25 49.85,4.25 48.85,5.25 48.85,5.75 48.35,6.25 IC26.15 | v29.1,69.62 28.6,70.12 28.6,71.75 V20.13 | V1.11 40.23,192.62 40.23,199.38 40.73,199.88 40.73,200.12 41.85,201.25 43.1,201.25 v43.1,203 43.6,203 46.48,205.88 73.58,205.88 82.6,196.86 v82.6,135.62 | v23.48,128.5 23.48,117.88 23.6,117.75 23.6,104.5 v23.98,104.12 24.1,104 24.1,93.25 23.73,92.88 23.73,88.5 24.23,88 24.23,75.25 v23.98,75 | v54.85,131 54.85,138.62 56.35,140.12 V8.11
BUSB_BIT4  (via drill 0.35)
  Top 0.152: v42.23,141.12 25.73,141.12 V9.6 21.98,137.38 12.1,137.38 v3.48,128.75 | V2.6 39.98,168.62 42.98,168.62 v44.1,167.5 46.48,167.5 v47.73,168.75 | v51.6,186 v60.48,186 | v59.23,48.88 59.23,49.75 59.6,50.12 59.6,53.12 30.48,53.12 28.6,51.25 V21.2 | v3.48,110.5 6.35,107.62 26.98,107.62 28.48,109.12 V13.2
  Bottom 0.152: v42.23,141.12 42.85,141.75 42.85,156.12 44.1,157.38 v44.1,167.5 | v60.48,186 62.35,187.88 62.35,199.62 62.23,199.75 C.39 | v51.6,186 49.98,184.38 49.98,173.38 47.73,171.12 v47.73,168.75 | V13.2 28.48,109.12 27.6,108.25 27.6,81.12 28.48,80.25 V17.2 28.48,80.12 27.6,79.25 27.6,55.5 28.48,54.62 28.48,51.25 V21.2 | v59.23,48.88 59.23,4.62 50.73,4.62 50.1,5.25 50.1,5.75 49.6,6.25 IC26.14 | v3.48,110.5 v3.48,128.75
BUSB_BIT5  (via drill 0.35)
  Top 0.152: v27.6,151 25.48,151 24.85,150.38 V9.2 | v60.23,204.25 60.1,204.12 29.48,204.12 v29.35,204 | V2.2 28.23,170.25 26.73,171.75 22.48,171.75 v21.85,172.38 14.97,165.5 v5.22,165.5 | v54.85,47.5 39.85,47.5 v39.6,47.75 | v4.1,119.5 11.72,111.88 31.48,111.88 32.6,110.75 34.6,110.75 36.1,109.25 V13.5
  Bottom 0.152: v27.6,151 27.6,169.5 28.23,170.12 V2.2 | v60.23,204.25 62.1,202.38 C.40 | v29.35,204 27.6,202.25 27.6,199 21.6,193 21.6,190.12 21.35,189.88 21.35,172.88 v21.85,172.38 | V13.5 36.1,109.12 35.23,108.25 35.23,81.12 36.1,80.25 V17.5 36.1,80.12 35.23,79.25 35.23,52.12 36.1,51.25 V21.5 36.23,51.12 v39.6,47.75 | v54.85,47.5 54.85,14.75 51.48,11.38 51.48,7 50.85,6.38 IC26.13 | v5.22,165.5 4.1,164.38 v4.1,119.5
BUSB_BIT6  (via drill 0.35)
  Top 0.152: v56.23,34.25 51.85,38.62 42.6,38.62 v42.48,38.5 | v42.23,57.25 37.73,57.25 36.23,58.75 V21.10 | v34.6,118.62 34.6,116.88 36.1,116.88 V13.10 | v26.35,162.12 26.85,161.62 v30.35,161.62 | v63.98,194.62 29.23,194.62 v28.6,194
  Bottom 0.152: v56.23,34.25 55.98,34 55.98,15.75 56.48,15.25 56.48,5 52.85,5 52.73,5.12 52.73,5.62 52.1,6.25 IC26.12 | v42.48,38.5 42.23,38.75 v42.23,57.25 | 37.1,88.75 36.23,87.88 V17.10 | 37.1,88.75 37.1,115.88 36.23,116.75 V13.10 | v34.6,118.62 34.6,123.12 34.35,123.38 34.35,125 34.6,125.25 34.6,130.75 34.23,131.12 34.23,148 33.35,148.88 33.35,149.38 32.48,150.25 V9.15 32.35,150.38 30.1,152.62 30.1,161.38 v30.35,161.62 | 27.35,176.88 26.98,176.5 26.98,163.75 26.35,163.12 v26.35,162.12 | 27.35,176.88 28.23,177.75 V2.15 | C.41 63.98,199.12 v63.98,194.62 | v28.6,194 27.35,192.75 27.35,176.88 | 37.1,88.75 37.1,59.75 36.23,58.88 V21.10
BUSB_BIT7  (via drill 0.35)
  Top 0.152: v55.48,48.88 54.73,49.62 v45.1,49.62 | v43.85,55.62 42.85,56.62 36.48,56.62 35.85,57.25 30.1,57.25 28.6,58.75 V21.13 | v30.1,138.25 30.48,138.25 32.35,140.12 V9.11 32.48,140.25 34.6,140.25 v34.85,140.5 | v63.23,194 62.98,194.25 46.48,194.25 v46.23,194 | v45.85,188.5 43.1,185.75 v41.48,185.75
  Bottom 0.152: v55.48,48.88 55.48,47.25 55.23,47 55.23,8.25 53.35,6.38 IC26.11 | v45.1,49.62 43.85,50.88 v43.85,55.62 | v30.1,138.25 29.73,137.88 29.73,118 28.6,116.88 V13.13 28.6,116.75 29.48,115.88 29.48,88.75 28.6,87.88 V17.13 28.6,87.75 29.73,86.62 29.73,63.38 29.1,62.75 29.1,59.38 28.6,58.88 V21.13 | v34.85,140.5 35.23,140.88 35.23,158.25 39.6,162.62 39.6,171 38.6,172 38.6,177.62 38.48,177.75 V2.11 39.35,178.75 39.35,183.62 v41.48,185.75 | v63.23,194 63.23,199.88 63.98,200.62 63.98,201.62 64.6,202.25 C.42 | v46.23,194 45.85,193.62 v45.85,188.5
BUSB_BIT8  (via drill 0.35)
  Top 0.152: v43.1,66.12 46.6,66.12 48.48,64.25 V22.2 | v42.85,91.75 42.98,91.62 46.98,91.62 48.48,93.12 V18.2 | V14.2 48.48,122.12 46.98,120.62 v43.6,120.62 39.73,120.62 v39.6,120.75 | v39.35,139.88 37.1,139.88 36.85,140.12 V10.6 | v60.48,162.25 60.23,162 v42.73,162
  Bottom 0.152: C.43 67.1,199.75 65.6,198.25 65.6,190.5 62.1,187 62.1,183.88 61.48,183.25 V3.6 61.35,183.12 60.98,182.75 60.98,179.38 60.48,178.88 v60.48,162.25 | v43.1,66.12 42.85,66.38 v42.85,91.75 43.1,92 43.1,120.12 v43.6,120.62 | v39.6,120.75 39.6,139.62 v39.35,139.88 39.1,140.12 39.1,144.62 39.85,145.38 39.85,159.12 v42.73,162
BUSB_BIT9  (via drill 0.35)
  Top 0.152: 60.35,181.62 67.35,181.62 v67.47,181.75 | 60.35,181.62 52.85,181.62 51.35,183.12 V3.2 | v62.85,69.62 61.6,69.62 56.23,64.25 V22.5 | v62.6,89.88 59.6,92.88 59.6,94.75 57.73,94.75 56.23,93.25 V18.5 | v57.85,149.38 37.73,149.38 36.85,150.25 V10.2 | v59.98,114.38 59.73,114.62 v57.1,114.62 | v60.35,181.75 60.35,181.62
  Bottom 0.152: v67.47,181.75 68.22,182.5 68.22,201.25 67.22,202.25 C.44 | v62.85,69.62 62.6,69.88 v62.6,89.88 62.23,90.25 62.23,106.25 59.98,108.5 v59.98,114.38 | 57.1,123.12 57.1,130.75 58.48,132.12 58.48,135.75 58.23,136 58.23,149 v57.85,149.38 58.98,150.5 58.98,153 60.73,154.75 60.73,158.12 59.85,159 59.85,162.5 60.1,162.75 60.1,181.5 v60.35,181.75 | 57.1,123.12 56.23,122.25 V14.5 | 57.1,123.12 v57.1,114.62
BUSB_BIT10  (via drill 0.35)
  Top 0.152: v64.35,74.38 58.73,74.38 56.23,71.88 V22.10 | v64.1,97.12 61.98,99.25 57.73,99.25 56.23,100.75 V18.10 56.1,100.88 55.23,100.88 v55.23,102.75 | v42.85,133 43.23,132.62 50.23,132.62 51.1,131.75 54.98,131.75 56.1,130.62 56.1,129.88 V14.10 | v43.48,154.75 43.23,154.5 v41.85,154.5
  Bottom 0.152: 48.98,193.12 48.35,193.75 48.35,202.75 51.1,205.5 70.72,205.5 70.72,201.25 69.85,200.38 69.85,199.88 C.45 | 48.98,193.12 51.23,190.88 V3.15 | v64.35,74.38 64.1,74.62 v64.1,97.12 | v55.23,102.75 55.23,123.25 56.1,124.12 56.1,129.75 V14.10 | 42.85,136 44.73,136 45.98,137.25 45.98,148.75 44.48,150.25 V10.15 | v42.85,133 42.85,136 | 48.98,193.12 47.48,191.62 47.48,184.75 45.48,182.75 45.48,175.5 45.98,175 45.98,160.62 45.73,160.38 45.73,157 v43.48,154.75 | v41.85,154.5 41.6,154.25 41.6,137.25 42.85,136
BUSB_BIT11  (via drill 0.35)  (2 unrouted)
  Top 0.152: v46.98,139.5 46.35,140.12 44.48,140.12 V10.11 | v47.1,73.25 48.48,71.88 V22.13 | v46.98,98.88 46.98,100.75 48.48,100.75 V18.13
  Bottom 0.152: V3.11 61.35,190.88 61.1,191.12 61.1,200.25 62.1,201.25 63.6,201.25 63.6,202.75 64.22,203.38 69.72,203.38 69.72,202.38 C.46 | v46.98,139.5 47.23,139.25 47.23,131.12 48.48,129.88 V14.13 | v47.1,73.25 47.35,73.5 47.35,86.5 46.98,86.88 v46.98,98.88
BUSB_BIT12  (via drill 0.35)
  Top 0.152: v70.35,198.25 71.85,199.75 72.22,199.75 C.47 | V4.6 61.48,170.25 62.98,171.75 68.47,171.75 70.47,169.75 70.47,168.12 69.72,168.12 v69.1,167.5 v67.1,167.5 | v57.73,125.5 56.35,124.12 53.6,124.12 51.98,122.5 51.98,120.5 v47.85,120.5 | v66.1,148.88 65.97,148.75 v62.23,148.75
  Bottom 0.152: v69.1,167.5 68.47,168.12 68.47,182.25 68.72,182.5 68.72,196.62 v70.35,198.25 | V23.2 48.48,51.25 47.6,52.12 47.6,72.88 48.48,73.75 48.48,80.12 V19.2 48.48,80.25 48.48,85.88 47.6,86.75 47.6,108.25 | 47.6,108.25 48.48,109.12 V15.2 | v57.73,125.5 57.73,130.88 58.85,132 58.85,135.88 58.6,136.12 58.6,140.12 60.73,140.12 V11.6 62.35,141.75 62.35,148.62 v62.23,148.75 | v47.85,120.5 47.6,120.25 47.6,108.25 | v67.1,167.5 66.1,166.5 v66.1,148.88
BUSB_BIT13  (via drill 0.35)
  Top 0.152: v58.35,151 60.1,151 60.73,150.38 V11.2 60.85,150.25 61.35,149.75 66.6,149.75 v66.72,149.62 | 56.1,168.12 55.6,168.62 52.85,168.62 51.35,170.12 V4.2 | 56.1,168.12 v57.23,167 | v69.1,168.5 68.72,168.12 56.1,168.12 | v64.35,113.38 62.85,111.88 58.85,111.88 56.23,109.25 V15.5
  Bottom 0.152: 55.23,79.25 55.23,57.75 55.6,57.38 55.6,51.75 56.1,51.25 V23.5 | 55.23,79.25 56.1,80.12 V19.5 | 55.23,79.25 55.23,101.88 55.85,102.5 55.85,108.88 56.1,109.12 V15.5 | v58.35,151 57.98,151.38 57.98,163.38 57.6,163.75 57.6,166.62 v57.23,167 | v69.1,168.5 68.85,168.75 68.85,169.88 69.1,170.12 69.1,190.12 70.97,192 70.97,201 72.22,202.25 C.48 | v64.35,113.38 65.85,114.88 65.85,143.88 66.72,144.75 v66.72,149.62
BUSB_BIT14  (via drill 0.35)
  Top 0.152: v62.85,150.38 68.35,150.38 V11.15 | v62.85,119.25 61.98,118.38 57.73,118.38 56.23,116.88 V15.10 | V4.15 51.35,177.75 53.23,175.88 62.35,175.88 v62.98,175.25 66.47,175.25 v70.1,178.88
  Bottom 0.152: 57.1,86.88 57.1,59.75 56.23,58.88 V23.10 | 57.1,86.88 56.23,87.75 V19.10 | 57.1,86.88 57.1,110.25 56.48,110.88 56.48,116.5 56.23,116.75 V15.10 | v62.85,119.25 v62.85,150.38 62.85,175.12 v62.98,175.25 | v70.1,178.88 69.85,179.12 69.85,189.25 72.1,189.25 73.35,190.5 73.35,198.38 74.72,199.75 C.49
BUSB_BIT15  (via drill 0.35)  (1 unrouted)
  Top 0.152: V4.11 63.1,179.5 v77.22,179.5 | v66.47,126.75 53.85,126.75 50.85,123.75 v49.73,123.75 | v75.6,141.05 75.28,141.38 69.6,141.38 68.47,140.25 V11.11
  Bottom 0.152: C.50 74.85,202.25 76.97,200.12 76.97,179.75 v77.22,179.5 77.85,178.88 77.85,166.75 78.1,166.5 78.1,162.88 75.6,160.38 v75.6,141.05 | 49.48,86.88 49.48,59.75 48.6,58.88 V23.13 | 49.48,86.88 48.6,87.75 V19.13 | 49.48,115.88 48.6,116.75 V15.13 | 49.48,86.88 49.48,115.88 | v66.47,126.75 66.47,138.25 68.35,140.12 V11.11 | v49.73,123.75 49.48,123.5 49.48,115.88
BUSR_BIT0  (via drill 0.35)  (10 unrouted)
  Top 0.152: 74.35,167.25 74.35,168.62 IC4.12 | 74.35,167.25 79.47,167.25 79.97,167.75 79.97,169.75 78.97,169.75 78.22,169 78.22,168.75 IC4.9 | v74.35,155.62 73.1,155.62 73.1,154.38 IC3.2 73.1,154.25 73.1,152.88 v77.85,152.88 | v74.35,158.38 74.35,159.62 IC3.12 | v74.35,166.5 74.35,167.25 | IC9.7 66.22,44.38 59.73,44.38 56.85,41.5 52.1,41.5 52.1,43.62 IC24.2
  Bottom 0.152: v74.35,155.62 v74.35,158.38 v74.35,166.5 | v77.85,152.88 78.22,152.5 v78.22,150.88
BUSR_BIT1  (via drill 0.35)  (3 unrouted)
  Top 0.152: v11.1,32.38 11.6,32.38 11.6,29.75 IC22.17 | v11.1,42.25 11.1,43.62 11.22,43.62 | 11.22,43.62 11.6,43.62 IC18.17 | 12.97,45.38 20.23,45.38 23.1,42.5 28.6,42.5 28.6,43.62 IC20.17 | 11.22,43.62 12.97,45.38 | v5.72,70 7.1,70 7.6,70.5 13.6,70.5 13.6,73.75 13.35,74 11.72,74 11.72,72.75 IC16.17 | v6.22,46.12 6.97,45.38 12.97,45.38 | v5.97,95.62 9.6,99.25 13.6,99.25 13.6,102.75 13.35,103 11.72,103 11.72,101.75 IC14.17 | v7.22,127.12 9.1,127.12 11.1,129.12 11.6,129.12 11.6,130.62 IC12.17 | 11.72,162 11.72,160.75 IC5.17 | 11.72,162 13.35,162 13.6,161.75 13.6,158.5 7.85,158.5 v5.97,156.62 | v11.1,190.25 11.6,190.25 11.6,191.62 IC1.17 | 11.72,162 v11.1,162.62
  Bottom 0.152: v11.1,42.25 v11.1,32.38 | v6.22,46.12 6.22,69.5 v5.72,70 5.72,70.75 5.97,71 v5.97,95.62 5.97,125.88 6.85,126.75 | 6.85,126.75 v7.22,127.12 | v5.97,156.62 6.85,155.75 6.85,126.75 | v11.1,162.62 v11.1,190.25
BUSR_BIT2  (via drill 0.35)  (1 unrouted)
  Top 0.152: 7.22,40.75 7.22,28.75 8.35,27.62 12.85,27.62 12.85,29.62 IC22.16 | 10.47,40.75 7.22,40.75 | 10.47,40.75 12.85,43.12 12.85,43.62 IC18.16 | 7.22,40.75 v6.85,41.12 | IC16.16 12.85,72.62 12.85,70.88 7.47,70.88 7.22,70.62 v6.47,70.62 v5.35,71.75 | v5.35,98.25 5.85,98.25 7.47,99.88 12.85,99.88 12.85,101.62 IC14.16 | v4.72,126.5 9.47,126.5 12.1,129.12 12.85,129.12 12.85,130.62 IC12.16 | 6.85,158.25 5.85,157.25 v4.72,157.25 | 6.85,158.25 7.47,158.88 12.85,158.88 12.85,160.62 IC5.16 | v8.6,189.5 11.22,189.5 11.47,189.75 12.85,189.75 12.85,191.62 IC1.16 | 6.85,158.25 v6.47,158.62 | 29.85,42.12 29.85,40.75 10.47,40.75 | 29.85,42.12 29.85,43.62 IC20.16 | 29.85,42.12 48.98,42.12 | 48.98,42.12 49.48,42.12 49.48,43.62 IC24.4 | 48.98,42.12 50.98,40.12 70.22,40.12 70.22,42.75 IC9.6
  Bottom 0.152: v6.47,70.62 6.85,70.25 v6.85,41.12 | v5.35,71.75 v5.35,98.25 4.72,98.88 v4.72,126.5 v4.72,157.25 | v8.6,189.5 6.47,187.38 v6.47,158.62
BUSR_BIT3  (via drill 0.35)  (7 unrouted)
  Top 0.152: v9.85,163.5 14.22,163.5 14.22,160.75 IC5.15 | v8.6,186.88 10.85,189.12 12.72,189.12 14.22,190.62 | 14.22,190.62 14.22,191.62 IC1.15 | v20.98,128.5 14.35,128.5 14.35,130.62 IC12.15 | v20.35,103.62 20.1,103.38 15.47,103.38 14.35,102.25 14.35,101.75 IC14.15 | 14.22,190.62 15.22,189.62 v21.98,189.62
  Bottom 0.152: v9.85,163.5 9.72,163.62 9.72,176.5 8.6,177.62 v8.6,186.88 | v20.35,103.62 20.98,104.25 v20.98,128.5 20.98,130.38 21.1,130.5 21.1,138.75 21.98,139.62 21.98,152.38 21.85,152.5 21.85,153.62 22.48,154.25 22.48,189.12 v21.98,189.62
BUSR_BIT4  (via drill 0.35)  (1 unrouted)
  Top 0.152: 13.6,132 9.97,132 9.72,131.75 9.72,129.5 5.1,129.5 3.6,128 3.46,128.14 3.22,128.14 2.87,128.5 2.87,129 3.6,129.73 3.6,149.12 | 13.6,132 15.47,132 15.47,130.75 IC12.14 | 3.6,149.12 8.1,149.12 8.47,149.5 8.47,157.75 13.85,157.75 15.47,159.38 15.47,160.62 IC5.14 | v11.47,193.25 15.47,193.25 15.47,191.75 IC1.14 | v16.48,42.12 15.6,43 15.6,43.62 IC18.14 | IC22.14 15.6,29.62 15.6,27.38 v16.48,27.38 20.98,27.38 v21.23,27.12 | v19.98,70.38 15.6,70.38 15.6,72.62 IC16.14 | v16.73,95.75 17.35,95.12 v19.98,95.12 | IC14.14 15.6,101.62 15.6,99.62 v16.73,99.62 22.48,99.62 v22.48,101 | v32.48,45.25 32.48,43.75 IC20.14 | v21.23,40.12 31.1,40.12 v32.48,41.5 v35.98,41.5 37.73,39.75 72.85,39.75 72.85,42.75 IC9.5 | v37.23,42.75 37.48,42.5 46.85,42.5 46.85,43.62 IC24.6 | 13.6,132 13.6,129.12 13.35,129.12 12.97,128.75 12.97,127.5 21.73,127.5 v22.35,126.88 | 3.6,149.12 v3.1,149.12
  Bottom 0.152: v11.47,193.25 3.1,184.88 v3.1,149.12 | v16.48,27.38 16.48,32.25 16.73,32.5 16.73,37.62 16.48,37.88 v16.48,42.12 | v21.23,27.12 v21.23,40.12 21.23,41.62 20.98,41.88 20.98,69.38 v19.98,70.38 19.73,70.62 19.73,71.75 19.98,72 19.98,82 20.35,82.38 20.35,94.75 v19.98,95.12 | v16.73,95.75 v16.73,99.62 | v32.48,41.5 v32.48,45.25 | v35.98,41.5 v37.23,42.75 | v22.35,126.88 22.23,126.75 22.23,101.25 v22.48,101
BUSR_BIT5  (10 unrouted)
BUSR_BIT6  (10 unrouted)
BUSR_BIT7  (via drill 0.35)  (1 unrouted)
  Top 0.152: 38.6,45 42.35,45 43.1,44.25 43.1,43.75 IC24.9 | 38.6,45 37.6,45 36.35,43.75 IC20.11 36.23,43.62 36.23,42.5 30.73,42.5 30.6,42.62 30.6,45 29.6,45 29.35,44.75 29.35,42.12 24.1,42.12 | v18.73,31.25 19.23,31.25 19.23,29.75 IC22.11 | IC18.11 19.23,43.62 18.73,43.62 v18.73,42.25 18.85,42.12 24.1,42.12 | v38.6,39.12 68.97,39.12 72.85,35.25 IC9.16 | 38.6,45 v38.6,44.75 | v20.73,161.62 20.23,161.62 19.35,160.75 IC5.11 | v20.23,190.5 20.23,191.62 19.35,191.62 IC1.11 | v21.98,73.12 19.73,73.12 19.35,72.75 IC16.11 | v21.85,100.25 20.48,101.62 19.35,101.62 IC14.11 | v22.23,128.62 20.6,130.25 19.73,130.25 19.35,130.62 IC12.11 | v21.35,152.12 21.85,151.62 v25.48,151.62 | v24.1,41.88 24.1,42.12
  Bottom 0.152: v18.73,42.25 v18.73,31.25 | v38.6,44.75 v38.6,39.12 | v20.23,190.5 20.98,189.75 20.98,161.88 v20.73,161.62 21.35,161 v21.35,152.12 | v25.48,151.62 26.35,150.75 26.35,132.75 v22.23,128.62 21.98,128.38 21.98,127.38 21.73,127.12 21.73,100.38 v21.85,100.25 21.85,93.25 22.85,92.25 22.85,74 v21.98,73.12 23.35,71.75 23.35,59.88 23.85,59.38 23.85,42.12 v24.1,41.88
BUSR_BIT8  (via drill 0.35)  (1 unrouted)
  Top 0.152: v28.1,28.25 v42.48,28.25 | v67.1,19.5 66.85,19.25 30.1,19.25 v28.6,17.75
  Bottom 0.152: IC2.18 10.47,169.25 10.47,149.38 11.1,148.75 11.1,146.5 10.47,145.88 10.47,138.38 IC6.18 10.47,138.25 10.47,119.38 11.1,118.75 11.1,115.12 10.47,114.5 10.47,108.38 IC13.18 10.47,108.25 10.47,90.38 11.1,89.75 11.1,80 10.47,79.38 IC15.18 10.47,79.25 10.47,61.5 11.1,60.88 11.1,51 10.47,50.38 IC17.18 10.47,50.25 10.47,17.38 11.1,16.75 11.1,5.62 | 11.1,5.62 10.47,6.25 IC19.18 | 11.1,5.62 11.1,5.12 12.97,3.25 27.48,3.25 27.48,6.25 IC23.18 27.48,6.38 27.48,13.75 28.1,14.38 28.1,17.75 | 28.1,17.75 28.1,19.62 27.48,20.25 IC21.18 27.48,20.38 27.48,27.62 v28.1,28.25 | v42.48,28.25 42.48,29 43.1,29.62 IC25.2 | v67.1,19.5 66.85,19.75 66.85,27.88 67.72,28.75 IC10.7 | 28.1,17.75 v28.6,17.75
BUSR_BIT9  (via drill 0.35)  (3 unrouted)
  Top 0.152: 52.1,19.62 63.73,19.62 65.22,21.12 IC10.13 | 52.1,19.62 29.6,19.62 v28.73,18.75 27.48,17.5 18.6,17.5 18.23,17.88 12.6,17.88 v12.35,17.62 | 52.1,19.62 v52.1,21.88 | v29.1,4.62 28.35,3.88 v13.72,3.88
  Bottom 0.152: v28.73,18.75 28.73,20.25 IC21.17 | v52.1,21.88 51.98,21.88 51.48,21.38 51.48,17.62 46.6,17.62 45.1,19.12 45.1,29 44.48,29.62 IC25.3 | v29.1,4.62 29.1,5.88 28.73,6.25 IC23.17 | v13.72,3.88 11.72,5.88 11.72,6.25 IC19.17 11.72,6.38 11.72,14.12 12.35,14.75 v12.35,17.62 12.35,21.5 11.72,22.12 11.72,50.25 IC17.17 11.72,50.38 12.35,51 12.35,61 11.72,61.62 11.72,79.25 IC15.17 | IC2.17 11.72,169.25 11.72,149.38 12.35,148.75 12.35,146.12 12.22,146 12.22,139.75 11.72,139.25 11.72,138.38 IC6.17
BUSR_BIT10  (via drill 0.35)  (2 unrouted)
  Top 0.152: 47.6,30 47.98,30.38 68.72,30.38 70.22,28.88 IC10.6 | 47.6,30 v45.73,28.12 | v30.6,31.25 31.85,30 47.6,30 | v13.6,11 v28.1,11
  Bottom 0.152: 29.35,11 29.35,16.88 29.85,17.38 29.85,20.25 IC21.16 29.98,20.38 30.6,21 v30.6,31.25 | 29.35,11 29.35,6.88 29.85,6.38 IC23.16 | v45.73,28.12 45.73,29.62 IC25.4 | IC2.16 12.97,169.25 13.6,168.62 13.6,141.5 12.97,140.88 12.97,138.38 IC6.16 12.97,138.25 12.97,119.5 13.6,118.88 13.6,109 12.97,108.38 IC13.16 12.97,108.25 13.6,107.62 13.6,97.5 13.85,97.25 13.85,90 13.6,89.75 13.6,83.62 12.97,83 12.97,79.38 IC15.16 | IC19.16 12.97,6.38 13.6,7 v13.6,11 13.6,20.88 12.97,21.5 12.97,50.25 IC17.16 | v28.1,11 29.35,11
BUSR_BIT11  (via drill 0.35)  (1 unrouted)
  Top 0.152: v67.47,23.75 66.6,24.62 51.23,24.62 49.73,26.12 47.1,26.12 v46.73,25.75 45.98,25 v31.85,25 31.6,25.25 v14.22,25.25
  Bottom 0.152: IC23.15 31.23,6.38 30.6,7 30.6,19.62 31.23,20.25 IC21.15 31.23,20.38 31.23,24.38 v31.85,25 | v46.73,25.75 46.73,29.5 46.85,29.62 IC25.5 | v67.47,23.75 67.47,21.5 67.72,21.25 IC10.14 | 13.97,25.25 13.97,32.25 14.22,32.5 14.22,50.25 IC17.15 14.35,50.38 14.85,50.88 14.85,64.62 14.22,65.25 14.22,79.25 IC15.15 14.35,79.38 14.85,79.88 14.85,89.88 14.22,90.5 14.22,108.25 IC13.15 14.35,108.38 14.35,113 14.85,113.5 14.85,118.75 14.22,119.38 14.22,138.25 IC6.15 14.22,138.38 14.22,140 14.85,140.62 14.85,168.75 14.35,169.25 IC2.15 | 13.97,25.25 13.97,22.38 14.85,21.5 14.85,6.88 14.35,6.38 IC19.15 | 13.97,25.25 v14.22,25.25
BUSR_BIT12  (via drill 0.35)  (1 unrouted)
  Top 0.152: 49.23,27.88 49.85,27.25 71.35,27.25 72.85,28.75 IC10.5 | 49.23,27.88 v48.85,28.25 | v16.1,8.25 v31.23,8.25 | 49.23,27.88 47.85,26.5 v38.85,26.5
  Bottom 0.152: v48.85,28.25 48.85,29.12 48.35,29.62 IC25.6 | 31.85,8.25 31.85,9.5 31.6,9.75 31.6,14.38 31.85,14.62 31.85,18.75 32.48,19.38 32.48,20.25 IC21.14 | 31.85,8.25 31.85,7 32.48,6.38 IC23.14 32.6,6.25 32.6,5 36.73,5 37.6,5.88 37.6,25.25 v38.85,26.5 | IC19.14 15.6,6.38 16.1,6.88 v16.1,8.25 16.1,21.25 15.47,21.88 15.47,50.25 IC17.14 15.6,50.38 16.1,50.88 16.1,67.5 15.47,68.12 15.47,79.25 IC15.14 15.6,79.38 16.1,79.88 16.1,107.75 15.6,108.25 IC13.14 15.6,108.38 15.6,113.12 16.1,113.62 16.1,118.88 15.47,119.5 15.47,138.25 IC6.14 15.6,138.38 15.6,146.12 16.1,146.62 16.1,168.75 15.6,169.25 IC2.14 | v31.23,8.25 31.85,8.25
BUSR_BIT13  (via drill 0.35)  (1 unrouted)
  Top 0.152: 50.35,24.62 51.85,23.12 68.35,23.12 70.22,21.25 IC10.15 | 50.35,24.62 v49.48,25.5 | v35.48,23.88 36.23,24.62 50.35,24.62 | v12.35,149.62 12.35,145.88 v16.23,145.88 | v17.35,10 v32.23,10
  Bottom 0.152: 33.1,10 33.1,16.75 33.23,16.88 33.23,18.75 33.73,19.25 33.73,20.25 IC21.13 33.85,20.38 34.48,21 34.48,22.88 v35.48,23.88 | 33.1,10 33.1,7 33.73,6.38 IC23.13 | v49.48,25.5 49.48,29.62 IC25.7 | IC19.13 16.85,6.38 17.35,6.88 v17.35,10 17.35,31.25 17.73,31.62 17.73,48.88 16.85,49.75 16.85,50.25 IC17.13 16.85,50.38 16.85,58.12 17.35,58.62 17.35,79.88 | 17.35,79.88 16.85,79.38 IC15.13 | 17.35,107.75 17.35,79.88 | 17.35,107.75 16.85,108.25 IC13.13 | 17.35,107.75 17.35,118.88 16.85,119.38 16.85,138.25 IC6.13 16.73,138.38 16.23,138.88 v16.23,145.88 | v12.35,149.62 12.35,170.5 15.97,170.5 16.1,170.38 16.1,170 16.73,169.38 IC2.13 | v32.23,10 33.1,10
BUSR_BIT14  (via drill 0.35)  (1 unrouted)
  Top 0.152: v51.48,32.25 64.6,32.25 66.1,30.75 73.47,30.75 73.85,30.38 | 73.85,30.38 75.35,28.88 IC10.4 | v81.47,32.25 79.6,30.38 73.85,30.38 | v18.6,9.38 v33.73,9.38 | v50.1,18.25 49.73,17.88 37.98,17.88 37.23,17.12 35.73,17.12 v35.6,17.25
  Bottom 0.152: v51.48,32.25 51.48,30.38 50.85,29.75 IC25.8 50.73,29.62 50.1,29 v50.1,18.25 | IC21.12 35.1,20.25 35.1,18.75 35.6,18.25 v35.6,17.25 35.28,16.93 34.62,16.93 34.49,16.8 34.49,14.65 35,14.15 35,9.38 | IC19.12 18.1,6.38 18.6,6.88 v18.6,9.38 18.6,30.5 18.1,31 18.1,50.25 IC17.12 18.1,50.38 18.6,50.88 18.6,61.38 18.1,61.88 18.1,79.25 IC15.12 18.1,79.38 18.6,79.88 18.6,90 18.1,90.5 18.1,108.25 IC13.12 18.1,108.38 18.1,109.25 18.6,109.75 18.6,118.88 18.1,119.38 18.1,138.25 IC6.12 18.1,138.38 18.1,139.25 18.6,139.75 18.6,168.75 18.1,169.25 IC2.12 | v33.73,9.38 35,9.38 | IC23.12 35.05,9.33 35,9.38
BUSR_BIT15  (via drill 0.35)  (2 unrouted)
  Top 0.152: v52.1,26.25 53.35,25 69.1,25 71.35,22.75 | 72.6,21.5 72.85,21.25 IC10.16 72.6,21.5 | 72.6,21.5 71.35,22.75 | v84.6,28.12 79.22,22.75 71.35,22.75 | 72.6,21.5 70.24,19.14 | 70.24,19.14 69.97,18.88 38.1,18.88 v36.98,17.75 v36.1,18.62 35.35,17.88 29.6,17.88 28.6,16.88 v20.23,16.88 | v52.62,13.5 59.5,13.5 59.75,13.25 68.75,13.25 70.25,14.75 IC11.6 70.25,14.88 70.25,19.12 70.24,19.14
  Bottom 0.152: v36.98,17.75 36.98,7 36.35,6.38 IC23.11 | v36.1,18.62 36.23,18.75 36.23,20.25 IC21.11 | v52.1,26.25 52.1,29.62 IC25.9 | IC2.11 19.35,169.25 19.35,159.12 19.98,158.5 19.98,139 19.35,138.38 IC6.11 19.35,138.25 19.35,119.38 19.98,118.75 19.98,110.5 19.35,109.88 19.35,108.38 IC13.11 19.35,108.25 19.35,90.38 19.98,89.75 19.98,82.5 19.35,81.88 19.35,79.38 IC15.11 19.35,79.25 19.35,62.38 19.98,61.75 19.98,51 19.35,50.38 IC17.11 19.35,50.25 19.35,21.5 19.98,20.88 19.98,16.88 | 19.98,16.88 19.98,7 19.35,6.38 IC19.11 | 19.98,16.88 v20.23,16.88 | v52.62,13.5 51,13.5 50,14.5 45.75,14.5 45.75,15.62 IC26.4
BUSR_FLAG_CARRY  (via drill 0.35)  (2 unrouted)
  Top 0.152: IC4.11 75.6,167.62 77.47,167.62 | 77.47,167.62 78.47,167.62 79.47,168.62 IC4.8 | 74.72,160.75 74.35,160.75 74.35,163.25 IC4.3 | 74.72,160.75 75.6,159.88 IC3.11 | 74.72,160.75 78.1,160.75 | 78.1,160.75 79.35,160.75 79.35,159.75 IC3.8 79.35,159.62 79.1,159.62 79.1,156.12 78.22,155.25 78.22,154.38 IC3.6 | 78.1,160.75 78.1,163.25 IC4.6 78.22,163.38 78.22,164.25 79.22,165.25 80.35,165.25 80.35,169.88 80.1,170.12 77.47,170.12 77.47,167.62 | v43.85,17.25 65.35,17.25 IC11.7
  Bottom 0.152: v43.85,17.25 43.85,16.38 43.23,15.75 IC26.2 | IC11.7 66.47,16.12 66.47,31.62 R1.1
BUSR_FLAG_N_OVERFLOW  (2 unrouted)
BUSR_FLAG_NONZERO  (1 unrouted)
  Bottom 0.152: IC26.3 44.48,15.62 44.73,15.38 44.73,7.62 45.1,7.25 45.1,5.12 46.35,3.88 65.22,3.88 65.22,7.12 IC11.13
CLOCK
  Top 0.152: C.5 18.85,199.75 14.47,195.38 8.6,195.38 1.69,188.47 1.69,10.41 4.6,7.5 58.48,7.5 59.73,8.75 61.1,8.75 62.6,7.25 IC11.12
  Bottom 0.152: 63.6,20.25 63.6,8.12 62.73,7.25 IC11.12 | 63.6,20.25 62.73,21.12 IC10.12 | 63.6,20.25 63.6,34.25 62.73,35.12 IC9.12
GND  (via drill 0.35)  (5 unrouted)
  Top 0.152: v53.6,28.12 54.23,28.75 60.1,28.75 IC10.10 | 66.22,5.62 61.73,5.62 60.23,7.12 IC11.11 | IC11.18 77.85,7.12 76.35,5.62 74.44,5.62 IC11.16 IC11.15 | v19.35,149.75 19.35,151.25 IC5.10 | v18.73,90.75 18.73,92.25 19.23,92.25 IC14.10 | v18.73,119.75 18.73,121.25 19.23,121.25 IC12.10 | 49.1,135.38 49.73,136 59.85,136 | 49.1,135.38 48.85,135.12 V8.8 49.1,135.38 | 59.85,136 60.73,135.12 V11.8 | 59.85,136 72.22,136 72.72,135.5 V7.7 | 49.1,135.38 46.35,135.38 45.73,136 v41.23,136 37.73,136 36.85,135.12 V10.8 36.73,135 35.85,134.12 31.48,134.12 30.6,135 24.85,135 V9.8 24.73,135 v18.73,135 | 68.6,184.25 77.97,184.25 78.85,183.38 79.35,183.38 V28.4 | 68.6,184.25 67.6,184.25 66.6,183.25 V3.8 | IC3.7 79.47,154.38 79.47,158.62 79.85,158.62 79.97,158.75 79.97,163.25 79.47,163.25 IC4.7 79.47,163.38 v79.47,164.62 | C.3 16.48,199.88 16.48,202.25 C.4 | 19.35,181.25 19.35,182.25 IC1.10 | 19.35,181.25 19.35,181 | 19.35,181.25 38.98,181.25 40.85,183.12 V1.7 40.98,183.25 43.48,183.25 V1.8 43.6,183.12 45.6,181.12 68.6,181.12 68.6,184.25 | v16.6,183.88 16.1,183.38 16.1,181 19.35,181 | 19.35,181 v19.35,180.75 | v40.23,111 40.23,109.25 41.1,109.25 V13.7 | v19.35,18.75 19.35,20.25 IC22.10 19.35,20.38 v20.35,21.38 | IC20.2 26.1,34.38 26.1,34.75 25.35,35.5 20.48,35.5 19.35,34.38 IC18.10 19.35,34.25 19.98,34.25 v19.98,32.88 20.23,32.62 32.1,32.62 33.35,31.38 v35.23,31.38 | v37.23,34 36.6,34 36.35,34.25 IC20.10 | IC16.10 19.23,63.25 19.1,63.25 v19.1,61.75 19.35,61.5 35.35,61.5 36.23,60.62 v40.23,60.62 | IC24.10 41.85,43.75 41.23,44.38 v40.98,44.38 40.48,44.38 v39.23,43.12 | IC11.5 72.88,14.88 75.38,14.88 IC11.4